# EAGLE design PVSN v1 (EAGLE 9.5.0)
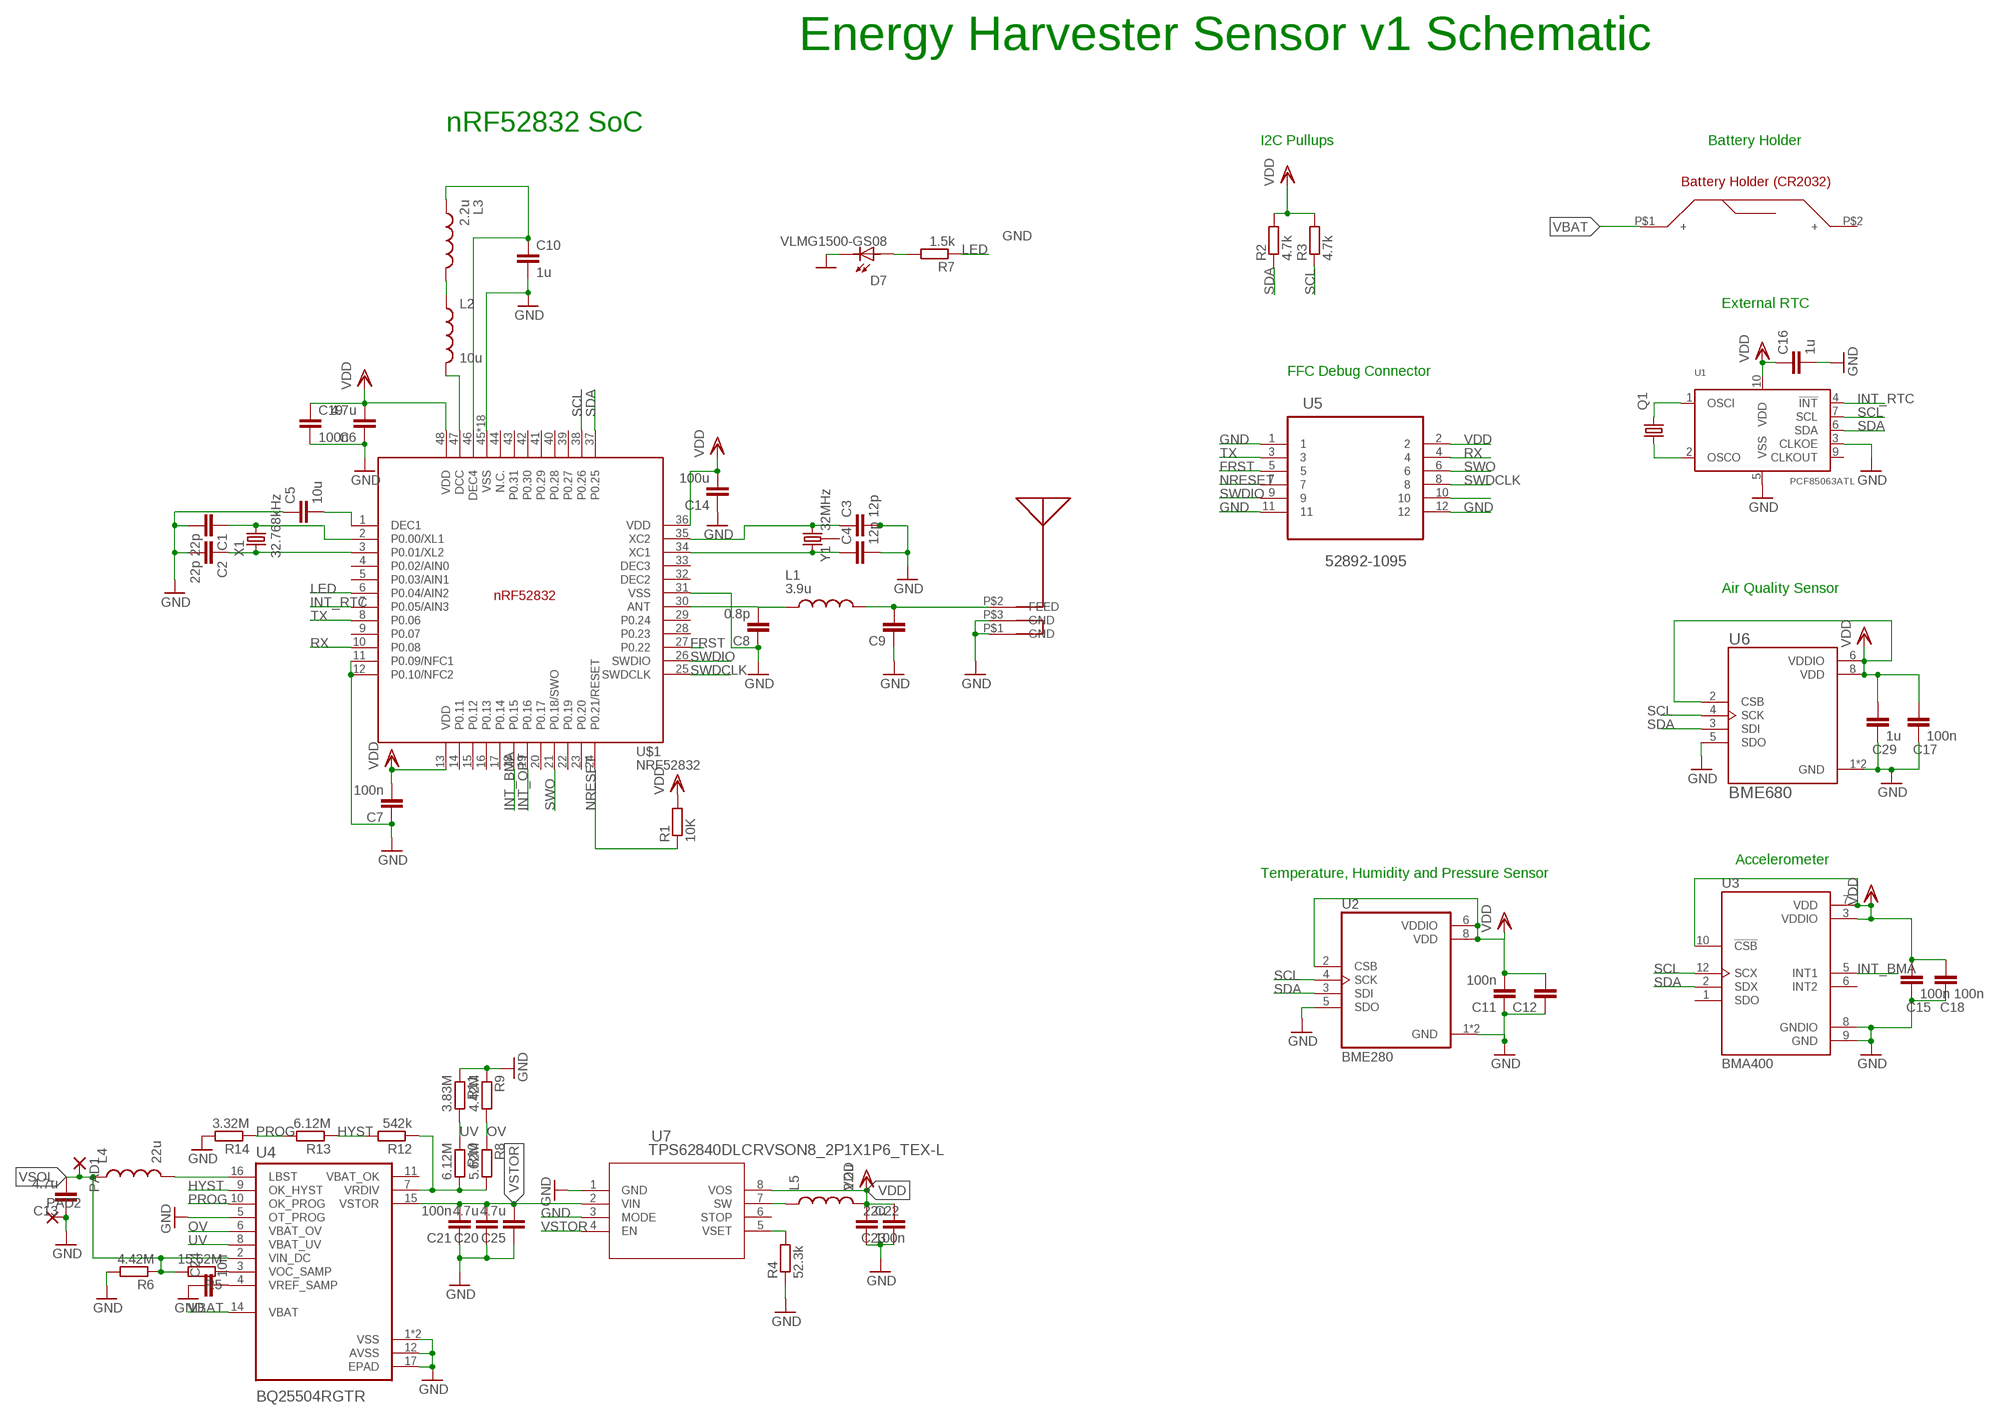
[diagram p0: schematic, sheet 1]

## Parts
C1  22p  CC0402  [C0402]
C2  22p  CC0402  [C0402]
C3  12p  CC0402  [C0402]
C4  12p  CC0402  [C0402]
C5  10u  CC0402  [C0402]
C6  4.7u  CC0402  [C0402]
C7  100n  CC0603R  [C0603R]
C8  0.8p  CC0402  [C0402]
C9  1.2p  CC0402  [C0402]
C10  1u  CC0402  [C0402]
C11  100n  CC0402  [C0402]
C12  1u  CC0402  [C0402]
C13  4.7u  CC0603R  [C0603R]
C14  100u  CC0402  [C0402]
C15  100n  CC0402  [C0402]
C16  1u  CC0603R  [C0603R]
C17  100n  CC0402  [C0402]
C18  100n  CC0402  [C0402]
C19  100n  CC0402  [C0402]
C20  4.7u  CC0402  [C0402]
C21  100n  CC0402  [C0402]
C22  100n  CC0402  [C0402]
C23  22u  CC0603R  [C0603R]
C24  10n  CC0402  [C0402]
C25  4.7u  CC0402  [C0402]
C29  1u  CC0402  [C0402]
D7  VLMG1500-GS08  [LEDC1005X35N]
L1  3.9u  MHQ0402P7N5JT000  [INDC0402X26N]
L2  10u  INDUCTOR  [L0603]
L3  2.2u  MHQ0402P7N5JT000  [INDC0402X26N]
L4  22u  INDUCTOR  [L0603]
L5  2.2u  INDUCTOR  [L0603]
PAD1  SMD2  [SMD1,27-2,54]
PAD2  SMD2  [SMD1,27-2,54]
Q1  KX-327-RT  [2.0X1.2]
R1  10K  RR0402  [R0402]
R2  4.7k  RR0402  [R0402]
R3  4.7k  RR0402  [R0402]
R4  52.3k  RR0402  [R0402]
R5  15.62M  RR0402  [R0402]
R6  4.42M  RR0402  [R0402]
R7  1.5k  RR0402  [R0402]
R8  5.62M  RR0402  [R0402]
R9  4.42M  RR0402  [R0402]
R10  6.12M  RR0402  [R0402]
R11  3.83M  RR0402  [R0402]
R12  542k  RR0402  [R0402]
R13  6.12M  RR0402  [R0402]
R14  3.32M  RR0402  [R0402]
U1  PCF85063ATL  [SOT1197-1]
U2  BME280  [PSON65P250X250X100-8N]
U3  BMA400  [XDCR_BMA400]
U4  BQ25504RGTR  [QFN50P300X300X100-17N]
U5  52892-1095  [MOLEX_52892-1095]
U6  BME680  [PSON80P300X300X100-8N]
U7  TPS62840DLCRVSON8_2P1X1P6_TEX-L  [VSON8_2P1X1P6_TEX-L]
U$1  NRF52832  [QFN40P600X600X90-48_N]
U$2  HOLDER  [HOLDER]
U$4  CHIPANTENNAL2  [CHIPANTENNAL2]
X1  32.768kHz  ABS07-32.768KHZ-T  [ABS07-32.768KHZ-T]
Y1  32MHz  CRYSTAL-26MHZSMD-3.2X2.5  [CRYSTAL-SMD-3.2X2.5MM]

## Nets
FRST: U5.5 U$1.27(P0.22)
GND: C1.2 C2.2 C3.2 C4.2 C5.1 C6.1 C7.1 C8.1 C9.1 C10.2 C11.1 C12.1 C13.1 C14.1 C15.2 C16.2 C17.2 C18.2 C19.2 C20.1 C21.1 C22.2 C23.1 C24.1 C25.1 C29.2 D7.2 PAD2.1(P) R4.1 R6.2 R9.1 R11.1 R14.2 U1.3(CLKOE) U1.5(VSS) U2.1(GND) U2.5(SDO) U2.7(GND) U3.8(GNDIO) U3.9(GND) U4.1(VSS) U4.5(OT_PROG) U4.12(AVSS) U4.13(VSS) U4.17(EPAD) U5.1 U5.11 U5.12 U6.1(GND) U6.5(SDO) U6.7(GND) U7.1(GND) U7.3(MODE) U$1.11(P0.09/NFC1) U$1.12(P0.10/NFC2) U$1.31(VSS) U$1.45(VSS) U$1.PAD(VSS) U$1.PAD@VIA01(VSS) U$1.PAD@VIA02(VSS) U$1.PAD@VIA03(VSS) U$1.PAD@VIA04(VSS) U$1.PAD@VIA05(VSS) U$1.PAD@VIA06(VSS) U$1.PAD@VIA07(VSS) U$1.PAD@VIA08(VSS) U$1.PAD@VIA09(VSS) U$1.PAD@VIA10(VSS) U$1.PAD@VIA11(VSS) U$1.PAD@VIA12(VSS) U$1.PAD@VIA13(VSS) U$1.PAD@VIA14(VSS) U$1.PAD@VIA15(VSS) U$1.PAD@VIA16(VSS) U$4.P$1(GND) U$4.P$3(GND)
HYST: R12.2 R13.1 U4.9(OK_HYST)
INT_BMA: U3.5(INT1) U$1.18(P0.15)
INT_OPT: U$1.19(P0.16)
INT_RTC: U1.4(!INT!) U$1.7(P0.05/AIN3)
LED: R7.1 U$1.6(P0.04/AIN2)
N$1: C1.1 U$1.2(P0.00/XL1) X1.2
N$2: C2.1 U$1.3(P0.01/XL2) X1.1
N$3: C3.1 U$1.35(XC2) Y1.3
N$4: C4.1 U$1.34(XC1) Y1.1
N$5: C5.2 U$1.1(DEC1)
N$6: C8.2 L1.1 U$1.30(ANT)
N$7: Q1.2 U1.1(OSCI)
N$8: Q1.1 U1.2(OSCO)
N$9: L2.2 U$1.47(DCC)
N$10: L2.1 L3.2
N$11: C10.1 L3.1 U$1.46(DEC4)
N$12: L4.2 U4.16(LBST)
N$13: R8.2 R10.2 R12.1 U4.7(VRDIV)
N$15: L5.1 U7.7(SW)
N$17: R4.2 U7.5(VSET)
N$18: C24.2 U4.4(VREF_SAMP)
N$19: D7.1 R7.2
N$20: R5.1 U4.3(VOC_SAMP)
N$21: U5.10
NRESET: R1.1 U5.7 U$1.24(P0.21/RESET)
OV: R8.1 R9.2 U4.6(VBAT_OV)
PROG: R13.2 R14.1 U4.10(OK_PROG)
RF: C9.2 L1.2 U$4.P$2(FEED)
RX: U5.4 U$1.10(P0.08)
SCL: R3.1 U1.7(SCL) U2.4(SCK) U3.12(SCX) U6.4(SCK) U$1.38(P0.26)
SDA: R2.1 U1.6(SDA) U2.3(SDI) U3.2(SDX) U6.3(SDI) U$1.37(P0.25)
SWDCLK: U5.8 U$1.25(SWDCLK)
SWDIO: U5.9 U$1.26(SWDIO)
SWO: U5.6 U$1.21(P0.18/SWO)
TX: U5.3 U$1.8(P0.06)
UV: R10.1 R11.2 U4.8(VBAT_UV)
VBAT: U4.14(VBAT) U$2.P$1(+)
VDD: C6.2 C7.2 C11.2 C12.2 C14.2 C15.1 C16.1 C17.1 C18.1 C19.1 C22.1 C23.2 C29.1 L5.2 R1.2 R2.2 R3.2 U1.10(VDD) U2.2(CSB) U2.6(VDDIO) U2.8(VDD) U3.3(VDDIO) U3.7(VDD) U3.10(!CSB) U5.2 U6.2(CSB) U6.6(VDDIO) U6.8(VDD) U7.8(VOS) U$1.13(VDD) U$1.36(VDD) U$1.48(VDD)
VSOL: C13.2 L4.1 PAD1.1(P) R5.2 R6.1 U4.2(VIN_DC)
VSTOR: C20.2 C21.2 C25.2 U4.15(VSTOR) U7.2(VIN) U7.4(EN)
Unconnected: U1.9(CLKOUT) U3.1(SDO) U3.6(INT2) U4.11(VBAT_OK) U7.6(STOP) U$1.4(P0.02/AIN0) U$1.5(P0.03/AIN1) U$1.9(P0.07) U$1.14(P0.11) U$1.15(P0.12) U$1.16(P0.13) U$1.17(P0.14) U$1.20(P0.17) U$1.22(P0.19) U$1.23(P0.20) U$1.28(P0.23) U$1.29(P0.24) U$1.32(DEC2) U$1.33(DEC3) U$1.39(P0.27) U$1.40(P0.28) U$1.41(P0.29) U$1.42(P0.30) U$1.43(P0.31) U$1.44(N.C.) U$2.P$2(+) Y1.2 Y1.4

## Notes on the sheet
- Energy Harvester Sensor v1 Schematic
- nRF52832 SoC
- I2C Pullups | Battery Holder
- External RTC
- FFC Debug Connector
- Air Quality Sensor
- Accelerometer
- Temperature, Humidity and Pressure Sensor

## Library data of the parts
C1-C6 C8-C12 C14 C15 C17-C22 C24 C25 C29 = eagle-ltspice:C: CAPACITOR, European symbol; SPICEMODEL: NONE; SPICEPREFIX: C
C7 C13 C16 C23 = eagle-ltspice:C: CAPACITOR, European symbol
D7 = VLMG1500-GS08:VLMG1500-GS08: 0402 GREEN 571nm 35MCD 65° Rectangle with Flat Top SMT LED; AVAILABILITY: Unavailable; DESCRIPTION: 0402 GREEN 571nm 35MCD 65° Rectangle with Flat Top SMT LED; MF: Vishay; MP: VLMG1500-GS08; PACKAGE: 0402 Vishay; PRICE: None
L1 L3 = MHQ0402P7N5JT000:MHQ0402P7N5JT000: 221 NH 5% GOLD TERMINAL; AVAILABILITY: Unavailable; DESCRIPTION: FIXED IND 7.5NH 200MA 1.2 OHM; MF: TDK; MP: MHQ0402P7N5JT000; PACKAGE: 0402 TDK; PRICE: None
L2 L4 L5 = BeagleBone_Blue_R3:INDUCTOR: Inductors Basic Inductor/Choke - 0603 and 1206. Footprints are not proven and vary greatly between part numbers. SRN6045- 33uH, 20% 1.4A
PAD1 PAD2 = wirepad:SMD2: SMD PAD
Q1 = crystal-geyer_V1_0:KX-327: Tuning Fork Crystals (kHz) SMD: KX327 - Serie Model Size l/w/h [mm] Frequency Range Frequency Stability Temp. Range [°C] Load Capacitance AECQ 200 availabel Datasheet KX-327VT KX-327FT KX-327RT KX-327NHT KX-327NHF KX-327L KX-327S 1.25/1.05/0.5 1.6/1.0/0.5 2.0/1.2/0.6 3.2/1.5/0.8 3.2/1.5/0.8 7.0/1.5/1.4 8.2/3.8/2.5 32,768 kHz 32,768 kHz 32,768 kHz 32,768 kHz 32,768 kHz 32,768 kHz 32,768 kHz ±10 … ±20ppm ±10 … ±20ppm ±10 … ±20ppm ±10 … ±20ppm ±10 … ±20ppm ±10 … ±20ppm ±5 … ±20ppm (*) -40°C …+85°C (*) -40°C …+85°C (*) -40°C …+85°C (*) -40°C …+85°C (*) -40°C …+125°C (*) -40°C …+85°C (*) -40°C …+85°C 7/9/12,5 7/9/12,5 7/9/12,6 7/9/12,5 9/12,5 7/9/12,5 6/12,5 - - - - yes - - KX-327VT.pdf <http://www.geyer-electronic.de/uploads/tx_userartikelfrequenz/GEYER-KX-327VT.pdf> KX-327FT.pdf <http://www.geyer-electronic.de/uploads/tx_userartikelfrequenz/GEYER-KX-327FT.pdf> KX-327RT.pdf <http://www.geyer-electronic.de/uploads/tx_userartikelfrequenz/GEYER-KX-327RT.pdf> KX-327NHT.pdf <http://www.geyer-electronic.de/uploads/tx_userartikelfrequenz/GEYER-KX-327NHT.pdf> KX-327NHF.pdf <http://www.geyer-electronic.de/uploads/tx_userartikelfrequenz/GEYER-KX-327NHF.pdf> KX-327L.pdf <http://www.geyer-electronic.de/uploads/tx_userartikelfrequenz/GEYER-KX-327L.pdf> KX-327S.pdf <http://www.geyer-electronic.de/uploads/tx_userartikelfrequenz/GEYER-KX-327S.pdf> <http://www.geyer-electronic.de/fileadmin/template/img/logo-geyer-electronic.png> Details see: http://www.geyer-electronic.de/Frequenz-Produkte.9.0.html Created 2016-06-07, Hans Locher 2016 (C) Geyer Quartz Technology KX327VT,KX327FT,KX327RT,KX327NHT,KX327NHF,KX327S,KX327L;125105;1610;2012;3215;7015;8238;1,25x1,05,1.25x1.05;1,6x1,0,1.6x1.0;2,0x1,2,2.0x1.2;3,2x1,5,3.2x1.5;8,2x3,8,8.2x3.8,7.0x1.5,7,0x1,532.768kHz
R1-R14 = eagle-ltspice:R: RESISTOR, European symbol; SPICEMODEL: NONE; SPICEPREFIX: R
U1 = PCF85063ATL:PCF85063ATL: Tiny Real-Time Clock/calendar with alarm function and I2C-bus The PCF85063A is a CMOS1 Real-Time Clock (RTC) and calendar optimized for low power consumption. An offset register allows fine-tuning of the clock. All addresses and data are transferred serially via the two-line bidirectional I2C-bus. Maximum data rate is 400 kbit/s. The register address is incremented automatically after each written or read data byte. AAL Eindhoven MK; AVAILABILITY: Unavailable; DESCRIPTION: Real Time Clock _RTC_ IC Clock/Calendar I²C, 2-Wire Serial 10-XFDFN Exposed Pad; MF: NXP USA; MP: PCF85063ATL; PACKAGE: DFN-10 NXP Semiconductors; PRICE: None
U2 = BME280:BME280: DIGITAL HUMIDITY, PRESSURE AND TEMPERATURE SENSOR * Digital interface I²C (up to 3.4 MHz) and SPI (3 and 4 wire, up to 10 MHz)* Supply voltage VDD main supply voltage range: 1.71 V to 3.6 V*VDDIO interface voltage range: 1.2 V to 3.6 V Operating range -40…+85 °C, 0…100 % rel. humidity, 300…1100 hPa The library has been designed by Richard Magdycz <https://www.facebook.com/groups/eaglecadsoftUK>; AVAILABILITY: Unavailable; DESCRIPTION: Integrated pressure, humidity and temperature sensor; 8-pin 2.5x2.5x0.93mm LGA; MF: Bosch; MP: BME280; PACKAGE: LGA-8 Bosch; PRICE: None
U3 = BMA400:BMA400: Ultra low power, 12-bit digital triaxial accelerometer; AVAILABILITY: Unavailable; DESCRIPTION: Accelerometer X, Y, Z Axis ±2g, 4g, 8g, 16g 12-LGA _2x2_; MF: Bosch Sensortec; MP: BMA400; PACKAGE: LGA-12 Bosch Tools; PRICE: None
U4 = BQ25504RGTR:BQ25504RGTR; AVAILABILITY: Unavailable; DESCRIPTION: Ultra Low Power Boost Converter with Battery Management for Energy Harvester | Nano-Power Management 16-VQFN -40 to 85; MF: Texas Instruments; MP: BQ25504RGTR; PACKAGE: VQFN-16 Texas Instruments; PRICE: None; TEXAS_INSTRUMENTS-PURCHASE-URL: https://snapeda.com/shop?store=Texas+Instruments&id=301842
U5 = 52892-1095:52892-1095: CONNECTOR, FPC, ZIF, 0.50MM, 10 WAY; AVAILABILITY: Unavailable; DESCRIPTION: Socket, r/a, Fpc, Zif, Smt, 10way; MF: Molex; MP: 52892-1095; PACKAGE: None; PRICE: None
U6 = BME680:BME680: Integrated Environmental Unit; AVAILABILITY: Unavailable; DESCRIPTION: Integrated Environmental Unit; MF: Bosch Sensortec; MP: BME680; PACKAGE: LGA-8 Bosch Tools; PRICE: None
U7 = TPS62840:TPS62840DLCR; BUILT_BY: EMA_Molly; COPYRIGHT: Copyright (C) 2018 Accelerated Designs. All rights reserved; MANUFACTURER_PART_NUMBER: TPS62840DLCR; SOURCELIBRARY: Texas_Instruments_2019-08-28; VENDOR: Texas Instruments
U$1 = Nordic_nRF:NRF52832: nRF52832 Features Single chip, highly flexible, 2.4 GHz multi-protocol SoC 32-bit ARM Cortex-M4F Processor 1.7v to 3.6v operation 512kB flash + 64kB RAM Supports concurrent Bluetooth Smart/ANT protocol operation On-chip NFC tag for Out-of-Band (OOB) pairing Up to +4dBm output power -96dBm sensitivity, Bluetooth Smart Thread safe and run-time protected Event driven API On air compatible with nRF24L and nRF24AP series 2 data rates (2Mbps/1Mbps) PPI - maximum flexibility for power-efficient applications and code simplification Automated power management system with automatic power management of each peripheral Configurable I/O mapping for analog and digital I/O 3 x Master/Slave SPI 2 x Two-wire interface (I²C) UART (RTS/CTS) 3 x PWM AES HW encryption Real Time Counter (RTC) Digital microphone interface (PDM) On-chip balun Applications Internet of Things (IoT) Wearables SmartHome sensors Connected white goods Computer peripherals Voice-command smart remotes A4WP ‘Rezence’ wireless charging Beacons Sports and fitness sensors and hubs Connected health products Smart watches RC Toys Interactive games Building automation and sensor networks
U$2 = batt holder:HOLDER
U$4 = CHIPANTENNA:CHIPANTENNAL2
X1 = Crystals:ABS07-32.768KHZ-T: CRYSTAL 32.7680KHZ 12.5PF SMD Manufacturer's datasheet <https://abracon.com/Resonators/ABS07.pdf>; CREATED_BY: PCBLayout.com; DIGIKEY_PART_NUMBER: 535-9542-2-ND; MANUFACTURER: Abracon LLC; MPN: ABS07-32.768KHZ-T; PACKAGE: SMD-2
Y1 = SparkFun-Clocks:CRYSTAL-26MHZ: 26MHz Crystal w/ Ground Pin Digikey Example <http://www.digikey.com/product-detail/en/epson/TSX-3225%2026.0000MF09Z-AC3/SER3627CT-ND/1802878> Frequency: 26MHz Frequency Stability: ±9ppm Frequency Tolerance: ±10ppm Load Capacitance: 9pF SparkFun Products: SparkFun ESP32 Thing <https://www.sparkfun.com/products/13907> SparkFun ESP8266 Thing Dev Board <https://www.sparkfun.com/products/13711>; PROD_ID: XTAL-12454

## Net classes
1 RF: clearance 0.4 mm

## Board
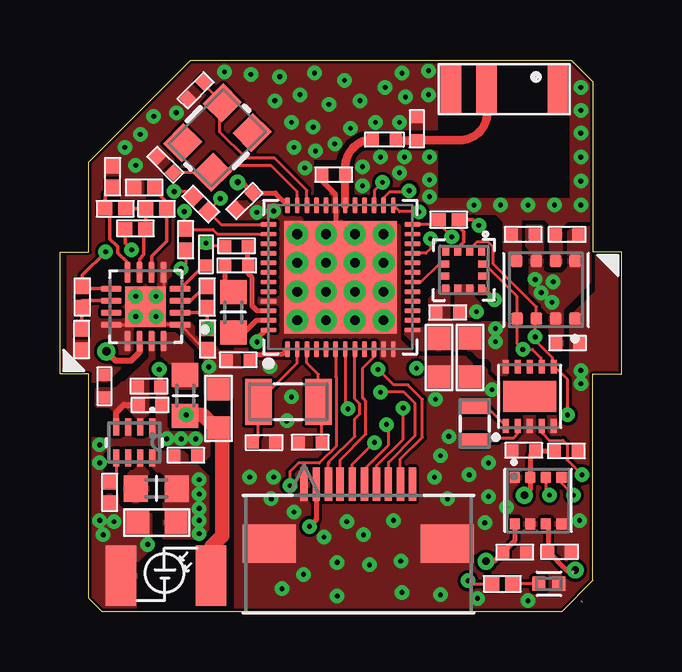
[diagram p1: board, top side]
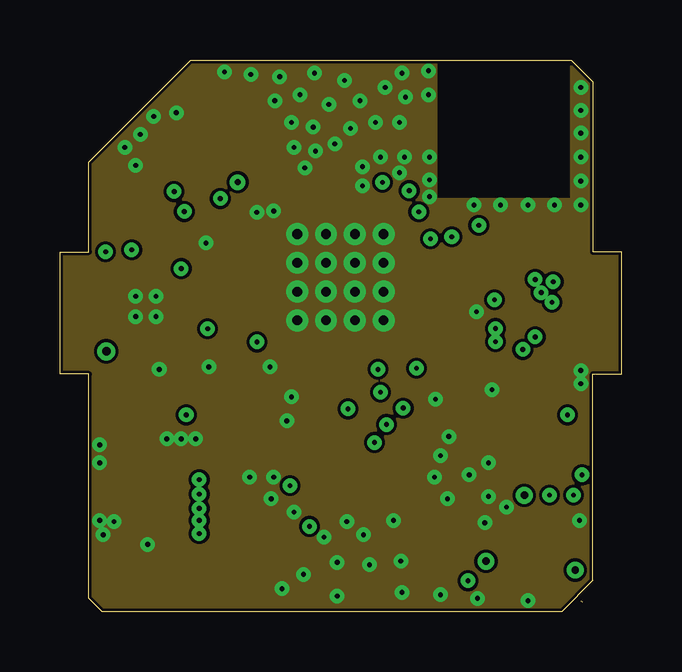
[diagram p2: board, inner layer GND]
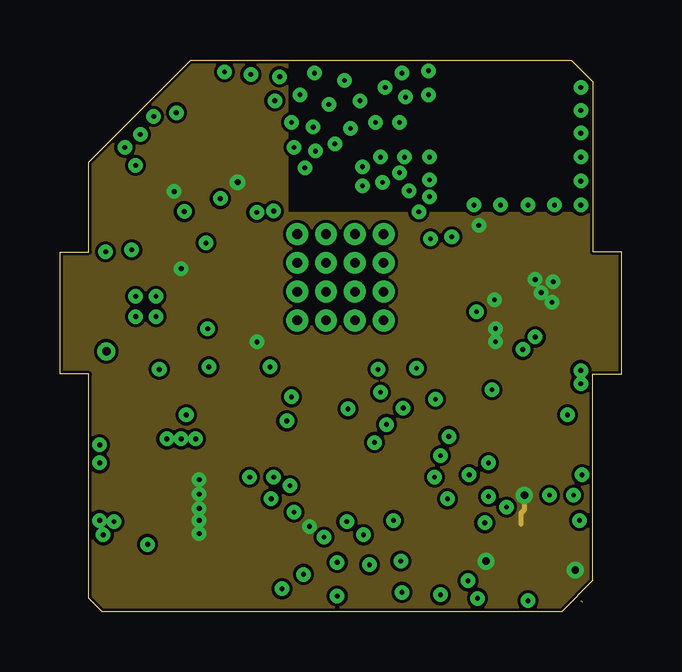
[diagram p3: board, inner layer VDD]
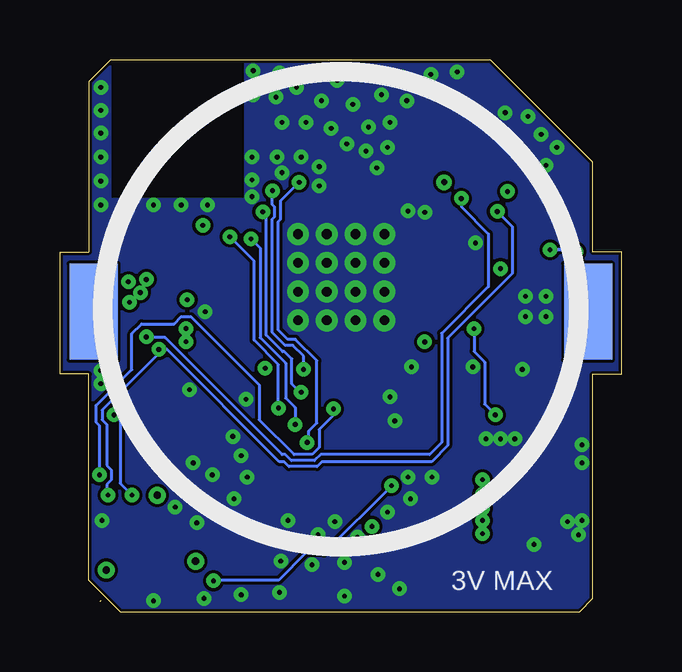
[diagram p4: board, bottom side, seen from below]

Size 23.4 x 23 mm. Coordinates in mm from the lower left corner, seen from the top.
Outline: 21.7,0.45 21.75,0.4
Outline: 5.45,23 21.3,23 22.2,22.1 22.2,15 23.4,15 23.4,9.9 22.2,9.9 22.2,1.3 20.9,0 1.75,0 1.2,0.55 1.2,9.9 0,9.9 0,15 1.2,15 1.2,18.75 5.45,23
Copper layers (1+2*15+16): Top 0.035mm / dielectric 0.2mm / GND 0.0175mm / dielectric 0.465mm / VDD 0.0175mm / dielectric 0.2mm / Bottom 0.035mm
Design rules "default *": minimum track width 5mil, minimum drill 0.2mm, track to track 5mil, track to pad 5mil, pad to pad 5mil, via to via 5mil, smd to smd 5mil, copper to edge 5mil, drill to drill 6mil, minimum pad ring 10mil, minimum via ring 8mil, stop-mask expansion 0mil, vias tented up to drill 40mil, thermal gap 0mil
tRestrict: area 10.6,17.5 to 11.9,18.8; 6 lines

### Footprints (pad centres in the part's own frame; a part is rotated, then mirrored left to right if it is on the bottom)
C0402 = smd 0.5 x 0.5: 1 -0.475,0; 2 0.475,0
C0603R = smd 0.95 x 0.95: 1 -0.85,0; 2 0.75,0
LEDC1005X35N = smd 0.59 x 0.61: 1 -0.415,0; 2 0.415,0
INDC0402X26N = smd 0.5 x 0.5: 1 -0.732,0; 2 0.232,0
L0603 = smd 1 x 1.1: 1 -0.85,0; 2 0.85,0
SMD1,27-2,54 = smd 1.27 x 2.54: 1 0,0
2.0X1.2 = smd 0.6 x 1.1: 1 -0.7,0; 2 0.7,0
R0402 = smd 0.6 x 0.55: 1 -0.425,0; 2 0.425,0
SOT1197-1 = smd 0.25 x 0.575: 1 -1,-1.238; 2 -0.5,-1.238; 3 0,-1.238; 4 0.5,-1.238; 5 1,-1.238; 6 1,1.238; 7 0.5,1.238; 8 0,1.238; 9 -0.5,1.238; 10 -1,1.238 | smd 2.2 x 1.3: CP 0,0
PSON65P250X250X100-8N = smd 0.49 x 0.45: 1 0.97,0.975; 2 0.97,0.325; 3 0.97,-0.325; 4 0.97,-0.975; 5 -0.97,-0.975; 6 -0.97,-0.325; 7 -0.97,0.325; 8 -0.97,0.975
XDCR_BMA400 = smd 0.35 x 0.3: 1 -0.775,0.75; 2 -0.775,0.25; 3 -0.775,-0.25; 4 -0.775,-0.75; 7 0.775,-0.75; 8 0.775,-0.25; 9 0.775,0.25; 10 0.775,0.75 | smd 0.3 x 0.35: 5 -0.25,-0.775; 6 0.25,-0.775; 11 0.25,0.775; 12 -0.25,0.775
QFN50P300X300X100-17N = smd 0.86 x 0.26: 1 -1.435,0.75; 2 -1.435,0.25; 3 -1.435,-0.25; 4 -1.435,-0.75; 9 1.435,-0.75; 10 1.435,-0.25; 11 1.435,0.25; 12 1.435,0.75 | smd 0.26 x 0.86: 5 -0.75,-1.435; 6 -0.25,-1.435; 7 0.25,-1.435; 8 0.75,-1.435; 13 0.75,1.435; 14 0.25,1.435; 15 -0.25,1.435; 16 -0.75,1.435 | smd 1.68 x 1.68: 17 0,0
MOLEX_52892-1095 = smd 0.305 x 1.397: 1 2.261,2.896; 2 1.753,2.896; 3 1.245,2.896; 4 0.762,2.896; 5 0.254,2.896; 6 -0.254,2.896; 7 -0.762,2.896; 8 -1.245,2.896; 9 -1.753,2.896; 10 -2.261,2.896 | smd 2.21 x 1.6: 11 -3.702,5.359; 12 3.702,5.359
PSON80P300X300X100-8N = smd 0.5 x 0.5: 1 1.2,1.2; 2 1.2,0.4; 3 1.2,-0.4; 4 1.2,-1.2; 5 -1.2,-1.22; 6 -1.2,-0.4; 7 -1.2,0.4; 8 -1.2,1.2
VSON8_2P1X1P6_TEX-L = smd 0.711 x 0.254: 1 -0.648,0.75; 2 -0.648,0.25; 3 -0.648,-0.25; 4 -0.648,-0.75; 5 0.648,-0.75; 6 0.648,-0.25; 7 0.648,0.25; 8 0.648,0.75
QFN40P600X600X90-48_N = smd 0.65 x 0.2: 1 -3,2.2; 2 -3,1.8; 3 -3,1.4; 4 -3,1; 5 -3,0.6; 6 -3,0.2; 7 -3,-0.2; 8 -3,-0.6; 9 -3,-1; 10 -3,-1.4; 11 -3,-1.8; 12 -3,-2.2; 25 3,-2.2; 26 3,-1.8; 27 3,-1.4; 28 3,-1; 29 3,-0.6; 30 3,-0.2; 31 3,0.2; 32 3,0.6; 33 3,1; 34 3,1.4; 35 3,1.8; 36 3,2.2 | smd 0.2 x 0.65: 13 -2.2,-3; 14 -1.8,-3; 15 -1.4,-3; 16 -1,-3; 17 -0.6,-3; 18 -0.2,-3; 19 0.2,-3; 20 0.6,-3; 21 1,-3; 22 1.4,-3; 23 1.8,-3; 24 2.2,-3; 37 2.2,3; 38 1.8,3; 39 1.4,3; 40 1,3; 41 0.6,3; 42 0.2,3; 43 -0.2,3; 44 -0.6,3; 45 -1,3; 46 -1.4,3; 47 -1.8,3; 48 -2.2,3 | smd 4.7 x 4.7: PAD 0,0 | drill 0.4: PAD@VIA01 -1.8,1.8; PAD@VIA02 -1.8,0.6; PAD@VIA03 -1.8,-0.6; PAD@VIA04 -1.8,-1.8; PAD@VIA05 -0.6,1.8; PAD@VIA06 -0.6,0.6; PAD@VIA07 -0.6,-0.6; PAD@VIA08 -0.6,-1.8; PAD@VIA09 0.6,1.8; PAD@VIA10 0.6,0.6; PAD@VIA11 0.6,-0.6; PAD@VIA12 0.6,-1.8; PAD@VIA13 1.8,1.8; PAD@VIA14 1.8,0.6; PAD@VIA15 1.8,-0.6; PAD@VIA16 1.8,-1.8
HOLDER = smd 2 x 4: P$1 10.3,-0.1; P$2 -10.3,-0.1
CHIPANTENNAL2 = smd 0.85 x 2: P$1 0.45,1; P$2 1.925,1; P$3 4.9,1
ABS07-32.768KHZ-T = smd 1.1 x 1.9: 1 -1.25,0; 2 1.25,0
CRYSTAL-SMD-3.2X2.5MM = smd 1.2 x 1.1: 1 -1.175,-0.875; 2 1.175,-0.875; 3 1.175,0.875; 4 -1.175,0.875

### Placement (x,y rotation side)
C1  8.5,7.05 0 top
C2  10.42,7.05 180 top
C3  4.39,18.63 135 top
C4  5.65,21.73 225 top
C5  7.43,10.5 0 top
C6  18.95,2.48 180 top
C7  15.79,10.64 90 top
C8  11.41,18.22 0 top
C9  14.87,20.13 270 top
C10  7.35,15.25 180 top
C11  20.81,2.49 180 top
C12  7.69,17.11 45 top
C13  6.6,8.42 270 top
C14  21.1,6.7 180 top
C15  16.16,12.47 0 top
C16  17.09,10.54 270 top
C17  19.3,15.73 180 top
C18  21.15,11.2 0 top
C19  21.12,15.73 180 top
C20  3.75,8.62 180 top
C21  3.71,9.39 180 top
C22  5.25,6.51 0 top
C23  4.08,3.71 0 top
C24  6.08,14.89 270 top
C25  1.85,9.4 270 top
C29  19.32,6.72 180 top
D7  20.37,1.16 0 top
L1  13.76,19.68 0 top
L2  7.23,12.48 270 top
L3  7.12,14.43 180 top
L4  5.21,9.01 90 top
L5  4.01,5.13 0 top
PAD1  6.3,1.5 0 top
PAD2  2.55,1.5 0 top
Q1  17.28,7.84 90 top
R1  16.2,16.34 0 top
R2  5.87,16.99 135 top
R3  5.24,15.5 270 top
R4  2.07,4.97 90 top
R5  6.13,13.12 270 top
R6  6.15,11.37 270 top
R7  18.43,1.15 0 top
R8  4.01,16.8 180 top
R9  3.5,17.68 0 top
R10  2.3,16.8 0 top
R11  2.19,18.14 270 top
R12  3.14,15.98 180 top
R13  0.92,13.12 270 top
R14  0.9,11.35 270 top
U1  19.57,8.97 0 top
U2  19.92,4.63 90 top
U3  16.82,14.24 270 top
U4  3.57,12.71 180 top
U5  12.43,8.2 180 top
U6  20.25,13.41 270 top
U7  3.09,7.04 270 top
U$1  11.68,13.94 90 top
U$2  11.7,12.61 0 bottom
U$4  15.84,20.78 0 top
X1  9.51,8.74 180 top
Y1  6.56,19.77 225 top

### Tracks (layer width: path | path; a pad name or v marks a point on that pad's centre or on a via)
FRST  (via drill 0.2)
  Top 0.127: U5.5 12.18,6.13 v13.1,7.05 | v13.44,17.9 13.09,17.56 13.09,16.95 U$1.27
  Bottom 0.127: v13.44,17.9 14.2,17.14 14.2,16.36 14.3,16.26 14.3,11.73 13.91,11.35 13.59,11.35 12.7,10.46 12.7,7.86 13.03,7.53 13.03,7.12 v13.1,7.05
GND  (via drill 0.2)
  Top 0.127: R6.2 6.01,10.94 5.63,11.31 5.63,11.32 U4.1 4.09,11.96 3.57,12.48 U4.17 | C10.2 6.21,15.25 C24.1 | U4.12 2.69,11.96 2.75,11.9 v3.15,12.3 | U4.5 4.32,13.46 v4,13.15
  Top 0.2: C8.1 10.93,17.94 11.48,17.39 U$1.31 11.48,15.36 11.5,15.35 11.47,15.35 U$1.PAD@VIA14 | C21.1 4.18,10.15 v4.13,10.1
  other vias: 1.65,3.8 2.25,3.75 1.8,3.2 3.65,2.8 1.65,6.2 1.65,6.95 4.45,7.2 5.05,7.2 5.65,7.2 6.2,10.2 8.8,4.7 7.9,5.6 8.9,5.6 9.45,7.95 9.65,8.95 8.75,10.2 17.35,12.5 15.4,18.95 15.4,18 15.4,17.3 17.25,16.95 18.35,16.95 19.5,16.95 20.6,16.95 21.7,16.95 21.7,17.95 21.7,18.95 21.7,19.95 21.7,20.9 21.7,21.85 18,9.25 21.7,10.05 19.5,0.45 17.4,0.55 15.85,0.7 14.25,0.8 11.55,0.65 9.25,0.95 10.15,1.55 11.55,2.05 12.9,1.95 14.2,2.1 12.65,3.2 13.9,3.8 11.95,3.75 11,3.1 9.75,4.15 16.15,4.7 17.7,3.7 18.6,4.35 17.85,4.8 17.05,5.7 17.85,6.2 15.85,6.5 10.65,19.2 10.2,18.5 12.6,17.75 14.15,18.3 14.35,18.95 13.35,18.95 12.6,18.55 11.45,19.5 12.1,20.15 13.15,20.4 14.15,20.4 12.5,21.3 13.55,21.85 11.2,21.15 15.35,21.55 15.35,22.55 14.4,21.45 14.25,22.45 11.85,22.15 10.55,20.2 9.75,19.35 9.65,20.4 8.95,21.3 10,21.55 10.6,22.45 9.15,22.3 7.95,22.4 16.2,7.3 3.15,18.6 4,12.3 2.7,19.35 6.85,22.5 3.35,19.9 3.9,20.65 4.85,20.8 3.15,13.15 8.9,16.7 8.2,16.65 6.08,15.37 21.65,3.8 21.7,9.5 15.6,5.6 15.65,8.85
  pour GND: 1.2,22.98 15.65,22.98 15.65,17.2 22.2,17.2 22.2,15 23.4,15 23.4,9.9 22.2,9.9 22.2,0 1.2,0 1.2,9.9 0,9.9 0,15 1.2,15
  pour Top: 15.57,16.65 10.9,16.65 10.47,17.07 10.47,17.3 9.72,18.05 4.6,18.05 -0.32,22.98 15.67,22.98 15.67,16.75
  pour Top: 7.33,17.1 9.35,17.1 10.17,16.27 13.95,16.27 14.12,16.1 14.12,11.35 14.85,10.62 16.88,10.62 17.27,10.22 17.62,10.22 17.75,10.1 17.75,9.93 18.12,9.55 22.2,9.55 22.2,0.05 7.33,0.05
  pour Top: 20.57,9.55 21.22,10.2 21.22,12.3 22.3,13.38 22.3,14.97 23.4,14.97 23.4,9.93 23.35,9.88 22.2,9.88 22.2,9.53 20.6,9.53
  pour Top: 14.32,17.2 22.15,17.2 22.15,16.3 21.15,16.3 20.88,16.02 20.88,14.45 20.45,14.45 20.45,16.12 20.2,16.38 19.18,16.38 19.18,14.47 18.8,14.47 18.72,14.55 18.72,14.9 18.5,15.12 18.5,16.25 18.15,16.6 14.92,16.6
  pour Bottom: 1.25,23 15.67,23 15.67,17.18 22.25,17.18 22.25,15.02 23.45,15.02 23.45,9.93 22.2,9.93 22.2,0.02 1.25,0.02 1.25,9.93 0.05,9.93 0.05,15.02 1.25,15.02
  pour Top: 21.3,17.18 21.3,22.98 22.18,22.1 22.18,17.2 22.15,17.18
  pour Top: 21.07,20.82 21.4,20.82 21.4,22.75 21.07,22.75
  pour Top: 15.62,20.85 15.95,20.85 15.95,22.7 15.62,22.7
  pour GND: 21.32,17.25 21.32,22.95 22.1,22.18 22.1,17.27 22.07,17.25
  pour Bottom: 21.3,17.25 21.3,22.98 22.1,22.18 22.1,17.27 22.07,17.25
  pour Top: 2.81,19.09 4.47,20.75 5.35,20.75 5.7,20.4 5.7,20.35 4.05,18.7 3.2,18.7
  pour Top: 16.55,12.35 16.55,13.55 17.15,13.55 17.15,13.1 17.45,12.8 17.45,12.35
  pour Top: 6,6.3 5.35,6.95 2.75,6.95 2.75,7.95 2.9,7.95 2.9,7.3 3,7.2 3.65,7.2 3.8,7.35 3.8,7.85 4.05,8.1 4.05,9.6 4.4,9.6 4.4,7.7 4.6,7.5 5.75,7.5 6.2,7.05 6.2,6.5
  pour Top: 3.2,0.2 3.2,2.05 3.8,2.65 3.8,4.05 3.65,4.2 2.65,4.2 2.4,4.45 2.4,4.85 1.75,4.85 1.75,6.6 2.1,6.95 2.75,6.95 2.75,7.2 1.25,7.2 1.25,0.05 3.05,0.05
  pour Top: 7.35,8.95 6.15,8.95 6.05,9.05 6.05,10.65 5.95,10.75 5.95,10.85 4.9,11.9 4.05,11.9 4.05,12.05 5.4,12.05 5.55,11.9 5.55,11.55 5.9,11.2 6.3,11.2 6.65,10.85 7.3,10.85 7.35,10.8
  pour Top: 1.95,9.6 0.35,9.6 0.35,21.45 0.6,21.7 2.2,21.7 4.7,19.2 4.7,14.1 4.4,13.8 4.4,13 3.15,11.75 3.15,10.8
GND19  (via drill 0.2)
  other vias: 14.85,10.15
HYST  (via drill 0.2)
  Top 0.15: U4.9 0.92,13.46 R13.1 0.92,14.03 v1.9,15 | R12.2 2.71,15.36 v2.99,15.09
  Bottom 0.15: v2.99,15.09 1.99,15.09 v1.9,15
INT_BMA
  Top 0.127: U$1.18 15.04,13.74 15.79,14.49 U3.5
INT_RTC  (via drill 0.2)
  Top 0.127: U$1.7 11.88,8.56 v12,8.45 | U1.4 20.1,7.7 20.1,7.42 20.38,7.14 20.95,7.14 21.13,6.96 21.13,6.32 v21.75,5.7
  Bottom 0.127: v12,8.45 12,8.2 12.61,7.59 12.61,6.85 12.89,6.56 13.64,6.56 13.65,6.55 15.1,8 15.1,9.45 17.95,12.29 18.35,12.29 18.65,12 20,12 20.41,11.59 20.41,10.09 21.9,8.6 21.9,7.89 21.75,7.74 v21.75,5.7
LED  (via drill 0.2)
  Top 0.127: U$1.6 11.48,9.79 11.51,9.77 11.51,6.89 10.81,6.19 9.94,6.19 9.58,5.83 9.58,5.26 v9.59,5.25 | v17,1.28 17.13,1.15 R7.1
  Bottom 0.127: v9.59,5.25 12.39,2.44 13.16,2.44 14.29,1.31 16.98,1.31 v17,1.28
N$1
  Top 0.127: C1.1 8.27,7.29 X1.2 9.88,10.36 U$1.2
N$2
  Top 0.127: C2.1 10.9,7.85 10.65,8.1 10.65,8.62 X1.1 10.76,9.89 10.29,10.37 U$1.3
N$3
  Top 0.127: U$1.35 9.88,17.52 8.81,18.59 7.33,18.59 7.05,18.32 Y1.3 4.75,18.32 C3.1
N$4
  Top 0.127: U$1.34 10.29,17.57 8.95,18.9 7.75,18.9 6.65,20 6.65,21.1 Y1.1 5.99,22 C4.1
N$5
  Top 0.2: C5.2 8.12,10.71 8.42,10.71 8.46,10.75 9.29,10.75 U$1.1
N$6
  Top 0.33: U$1.30 C8.2
  Top 0.35: C8.2 11.88,18.54 arc-90 L1.1
N$7
  Top 0.127: Q1.2 17.77,8.54 U1.1
N$8
  Top 0.127: Q1.1 18.23,7.13 18.35,7.25 18.9,7.25 19.07,7.42 U1.2
N$9
  Top 0.2: U$1.47 8.19,12.14 7.67,11.63 L2.2
N$10
  Top 0.2: L2.1 6.88,13.67 L3.2
N$11
  Top 0.2: C10.1 7.83,14.45 L3.1 7.85,14.08 8,13.92 8,12.75 8.21,12.54 U$1.46
N$12
  pour Top: 4.75,9.35 4.75,10.15 4.25,10.65 4.25,11.6 4.8,11.6 5.5,10.9 5.5,10.45 5.65,10.3 5.65,9.3 4.8,9.3
N$13
  Top 0.15: U4.7 3.32,14.7 3.49,14.88 3.49,15.9 R12.1 3.57,16.77 R8.2 R10.2
N$15
  pour Top: 2.7,4.55 2.7,5.6 2.95,5.85 3.05,5.85 3.25,6.05 3.25,6.2 3.45,6.2 3.45,6.05 3.65,5.85 3.65,4.55
N$17
  Top 0.127: U7.5 2.34,5.67 R4.2
N$18
  Top 0.15: U4.4 5.03,13.46 5.99,14.42 C24.2
N$19
  Top 0.127: D7.1 R7.2
N$20
  Top 0.15: U4.3 5.45,12.96 6.03,13.54 R5.1
NRESET  (via drill 0.2)
  Top 0.127: v14.3,8.48 v14.29,8.48 14.29,7.19 13.19,6.08 U5.7 | R1.1 15.71,16.29 | 15.71,16.29 15.56,16.14 U$1.24 | v16.32,15.62 15.71,16.24 15.71,16.29
  Bottom 0.127: v16.32,15.62 15.32,14.62 15.32,11.31 14.3,10.3 v14.3,8.48
OV
  Top 0.15: U4.6 3.82,14.81 4.44,15.44 R8.1 4.44,17.07 3.93,17.59 R9.2
PROG
  Top 0.15: U4.10 0.92,12.96 R13.2 0.9,12.67 R14.1
RF
  Top 0.35: L1.2 14.05,19.64 14.85,19.64 C9.2 16.66,19.66 arc90 17.8,20.8 17.8,21.75 arc90 U$4.P$2
RX
  Top 0.127: U5.4 11.67,6.32 12.75,7.4 12.75,8.76 12.61,8.9 12.61,10.15 13.08,10.63 U$1.10
SCL  (via drill 0.2)
  Top 0.127: U$1.38 6.56,15.74 6.37,15.93 R3.1 5.18,15.99 v5.18,16.68 | U1.7 20.04,10.25 20.04,10.58 19.68,10.93 v19.28,10.93 19.05,11.16 U6.4 19.05,13.14 17.8,14.39 17.8,14.4 17.7,14.49 U3.12 | v21.4,4.85 20.89,5.36 U2.4
  Bottom 0.127: v21.4,4.85 21.45,4.9 21.45,5.3 21.26,5.5 21.26,5.9 21.45,6.1 21.45,7.8 21.64,7.99 21.64,8.4 19.28,10.77 v19.28,10.93 19.27,10.95 18.95,10.95 14.25,6.25 14.06,6.25 13.86,6.04 12.69,6.04 12.49,6.25 7.92,6.25 7.25,6.92 7.25,11.4 4.56,14.09 4.56,16.06 v5.18,16.68
SDA  (via drill 0.2)
  Top 0.127: U$1.37 6.71,16.14 R2.1 6.68,17.2 v6.68,17.22 | 20.57,10.25 U1.6 | U3.2 17.07,15.11 17.36,15.4 17.85,15.4 18.05,15.2 18.05,14.5 19.85,12.7 U6.3 19.8,12.16 v19.8,11.45 19.8,11.31 20.52,10.59 20.52,10.3 20.57,10.25 | U2.3 20.25,5 v20.4,4.85 | v21.15,8.2 21.15,9.67 20.57,10.25
  Bottom 0.127: v6.68,17.22 6.68,16.88 5.55,15.75 5.55,13.55 7.5,11.6 7.5,7.05 8,6.55 12.54,6.55 12.8,6.3 13.75,6.3 14.01,6.55 14.15,6.55 19.02,11.42 19.8,11.42 v19.8,11.45 | v21.15,8.2 20.9,7.95 20.9,5.35 v20.4,4.85
SWDCLK  (via drill 0.2)
  Top 0.127: U5.8 13.69,5.32 13.69,6.22 14.8,7.34 14.8,8.68 14.33,9.15 v13.35,9.15 | v14.95,16.67 14.15,16.67 U$1.25
  Bottom 0.127: v13.35,9.15 13.4,9.15 13.74,9.49 13.74,10.53 14.05,10.84 14.12,10.84 14.81,11.53 14.81,16.53 v14.95,16.67
SWDIO  (via drill 0.2)
  Top 0.127: U5.9 14.18,6.36 15.1,7.27 15.1,8.85 14.49,9.45 13.9,9.45 v13.25,10.1 | v14.55,17.55 14.5,17.5 13.73,17.5 13.48,17.26 U$1.26
  Bottom 0.127: v13.25,10.1 13.25,10.65 13.7,11.1 14.02,11.1 14.55,11.63 14.55,16.37 14.46,16.47 14.46,16.88 14.55,16.97 v14.55,17.55
SWO  (via drill 0.2)
  Top 0.127: U5.6 12.68,5.94 13.69,6.95 13.69,7.71 v13.6,7.8 | v15.44,15.54 15.44,15.14 15.24,14.94 U$1.21
  Bottom 0.127: v13.6,7.8 13.6,8.5 14,8.9 14,10.36 15.06,11.42 15.06,15.16 v15.44,15.54
TX
  Top 0.127: U5.3 11.18,6.18 11.2,6.2 11.2,6.23 12.29,7.31 12.29,8.04 12.49,8.24 12.49,8.65 12.29,8.86 U$1.8
UV
  Top 0.15: U4.8 2.81,14.54 2.41,14.96 2.41,15.21 2.08,15.53 2.08,16.6 R10.1 1.88,17.4 R11.2
VBAT  (via drill 0.35)
  Top 0.254: U4.14 3.32,10.81 2.95,10.45 2.33,10.45 v1.93,10.85
  Bottom 0.2: U$2.P$1 1.4,11.38 v1.93,10.85
VDD  (via drill 0.2, 0.25, 0.3)
  Top 0.127: R2.2 5.34,17.51 v4.76,17.51 | R3.2 5.24,14.48 v5.05,14.3
  Top 0.152: U3.3 16.57,15.16 16.83,15.41 16.83,15.84 16.62,16.05 R1.2 17.2,16.34 v17.45,16.1
  Top 0.2: U$1.48 8.58,11.74 8.21,11.36 v8.21,11.24 | U$1.36 8.97,17.45 C12.2 7.57,17.9 v7.4,17.9 | C14.2 19.82,6.7 C29.1 19.59,6.53 U2.2 19.59,5.09 v19.35,4.85 | U2.8 18.95,2.95 C6.2 18.09,2.1 v17.75,2.1 | U2.6 20.34,3.57 C11.2 21.1,1.73 v21.47,1.73 | U5.2 10.68,3.83 v10.4,3.55 | U3.10 17.63,13.47 v18.1,13
  VDD 0.2: v19.35,4.85 19.35,4.25 19.2,4.1 19.2,3.65
  other vias: 5.8,5.5 5.8,4.9 5.8,4.3 5.8,3.8 5.8,3.25 18.15,11.25 18.15,11.8 20.5,12.9 20.05,13.3 20.55,13.75 19.8,13.85
  pour Top: 17.15,10.9 15.05,10.9 14.4,11.55 arc0 14.4,11.8 15.12,11.8 15.4,12.07 15.4,13.05 15.92,13.57 16.18,13.57 16.2,13.55 16.2,12.2 16.35,12.05 18.55,12.05 18.6,12 18.6,9.88 18.2,9.88 18.02,10.05 18.02,10.38 17.8,10.6 17.45,10.6
  pour Top: 20.43,10.97 20.43,12.38 19.6,13.2 19.6,15.07 19.45,15.23 19.45,16.07 20.07,16.07 20.1,16.05 20.1,14.22 20.25,14.07 20.93,14.07 21.2,14.35 21.2,15.85 21.38,16.02 22.07,16.02 22.07,13.72 20.93,12.57 20.93,10.97
  pour VDD: 1.2,22.98 9.45,22.98 9.45,16.62 22.2,16.62 22.2,14.95 23.4,14.95 23.4,9.85 22.2,9.85 22.2,0 22.15,-0.05 1.2,-0.05 1.2,9.85 0,9.85 0,14.95 1.2,14.95
  pour Top: 4.4,4.6 4.4,5.65 4.2,5.85 4.05,5.85 3.75,6.15 3.75,6.65 5.15,6.65 6.15,5.65 6.15,3.4 5.8,3.05 4.35,3.05 4.35,4.55
VSOL  (via drill 0.2)
  Top 0.15: U4.2 5.9,12.46 R5.2 6.13,11.81 R6.1
  Top 0.61: L4.1 v5.26,8.2 5.95,8.2 6.48,7.67 C13.2 6.75,7.52 6.75,3.15 6.3,2.7 PAD1.1
  Bottom 0.127: R6.1 6.15,10.85 5.71,10.4 5.71,8.65 v5.26,8.2
  other vias: 6.15,11.79
VSTOR
  Top 0.254: U7.4 2.34,8.29 2.67,8.62 C20.2
  pour Top: 2.7,8.6 2.7,9.55 3.75,10.6 3.75,11.65 3.9,11.65 3.9,9.95 3.65,9.7 3.65,8.25 3.45,8.05 3.45,7.95 3.35,7.95
  pour Top: 2.3,8.3 2.05,8.55 1.55,8.55 1.5,8.6 1.5,9.25 1.55,9.3 2.35,9.3 2.6,9.55 2.7,9.55 2.75,9.5 2.75,8.65 2.4,8.3

### Text on the board
bPlace: 3V MAX